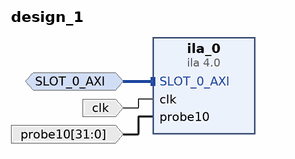
[diagram p0: block diagram of the top level]
# Vivado block design design_1, Vivado 2014.2
create_bd_design design_1

create_bd_intf_port -mode Monitor -vlnv xilinx.com:interface:aximm_rtl:1.0 SLOT_0_AXI
set_property -dict {CONFIG.DATA_WIDTH 32 CONFIG.PROTOCOL AXI4 CONFIG.ADDR_WIDTH 32} [get_bd_intf_ports SLOT_0_AXI]
create_bd_port -dir I -type clk clk
create_bd_port -dir I -from 31 -to 0 probe10

create_bd_cell -type ip -vlnv xilinx.com:ip:ila:4.0 ila_0

# ---- connections ----

connect_bd_intf_net [get_bd_intf_pins ila_0/SLOT_0_AXI] [get_bd_intf_ports SLOT_0_AXI]
connect_bd_net [get_bd_ports clk] [get_bd_pins ila_0/clk]
connect_bd_net -net probe10_1 [get_bd_ports probe10] [get_bd_pins ila_0/probe10]

validate_bd_design
save_bd_design
